# EAGLE design board (EAGLE 8.3.1)
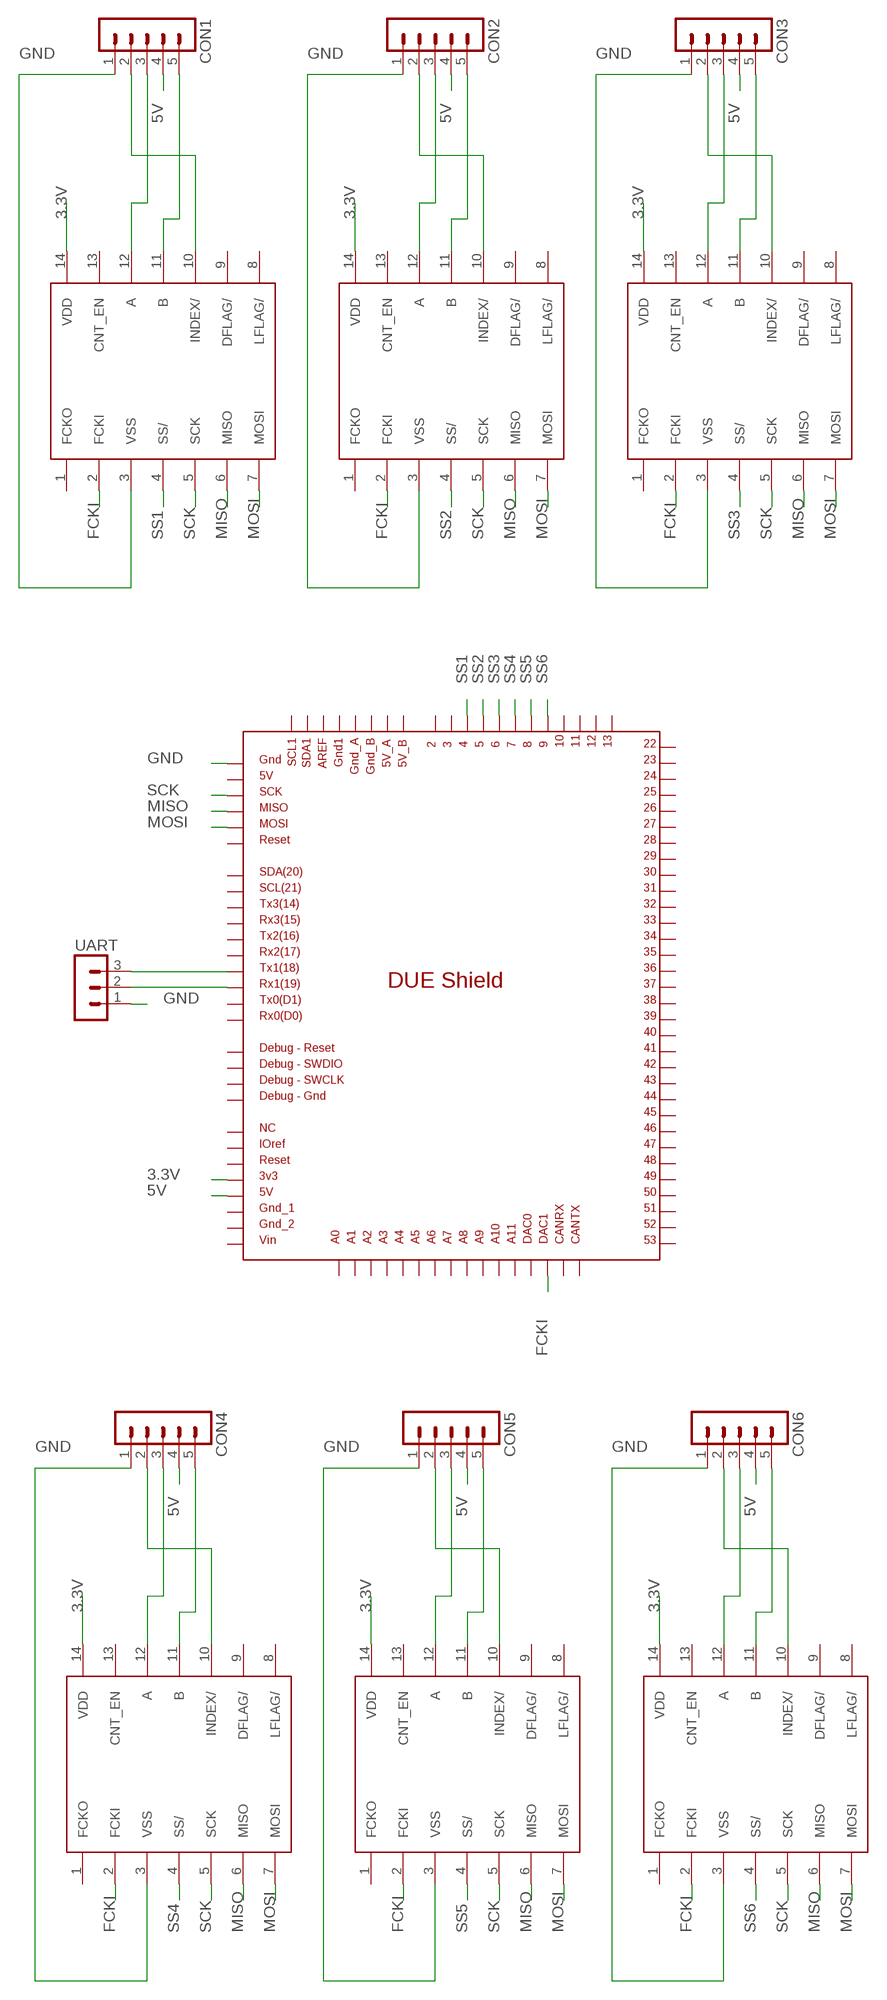
[diagram p0: schematic, sheet 1]

## Parts
CON1  MA05-1  [MA05-1]
CON2  MA05-1  [MA05-1]
CON3  MA05-1  [MA05-1]
CON4  MA05-1  [MA05-1]
CON5  MA05-1  [MA05-1]
CON6  MA05-1  [MA05-1]
IC1  LFLS7366R  [SO14]
IC2  LFLS7366R  [SO14]
IC3  LFLS7366R  [SO14]
IC4  LFLS7366R  [SO14]
IC5  LFLS7366R  [SO14]
IC6  LFLS7366R  [SO14]
U$7  DUE(NORMAL)  [DUE(NORMAL)]
UART  MA03-1  [MA03-1]

## Nets
3.3V: IC1.14(VDD) IC2.14(VDD) IC3.14(VDD) IC4.14(VDD) IC5.14(VDD) IC6.14(VDD) U$7.3V3
5V: CON1.4 CON2.4 CON3.4 CON4.4 CON5.4 CON6.4 U$7.5V
FCKI: IC1.2(FCKI) IC2.2(FCKI) IC3.2(FCKI) IC4.2(FCKI) IC5.2(FCKI) IC6.2(FCKI) U$7.DAC1
GND: CON1.1 CON2.1 CON3.1 CON4.1 CON5.1 CON6.1 IC1.3(VSS) IC2.3(VSS) IC3.3(VSS) IC4.3(VSS) IC5.3(VSS) IC6.3(VSS) U$7.5V_ICSP UART.1
MISO: IC1.6(MISO) IC2.6(MISO) IC3.6(MISO) IC4.6(MISO) IC5.6(MISO) IC6.6(MISO) U$7.MISO_ICSP
MOSI: IC1.7(MOSI) IC2.7(MOSI) IC3.7(MOSI) IC4.7(MOSI) IC5.7(MOSI) IC6.7(MOSI) U$7.MOSI_ICSP
N$2: CON2.2 IC2.10(INDEX/)
N$3: U$7.TX1 UART.3
N$4: U$7.RX1 UART.2
N$5: CON2.3 IC2.12(A)
N$7: CON2.5 IC2.11(B)
N$8: CON3.2 IC3.10(INDEX/)
N$9: CON3.3 IC3.12(A)
N$10: CON3.5 IC3.11(B)
N$12: CON1.2 IC1.10(INDEX/)
N$13: CON1.3 IC1.12(A)
N$14: CON1.5 IC1.11(B)
N$16: CON5.2 IC5.10(INDEX/)
N$17: CON5.3 IC5.12(A)
N$18: CON5.5 IC5.11(B)
N$20: CON6.2 IC6.10(INDEX/)
N$21: CON6.3 IC6.12(A)
N$22: CON6.5 IC6.11(B)
N$24: CON4.2 IC4.10(INDEX/)
N$25: CON4.3 IC4.12(A)
N$26: CON4.5 IC4.11(B)
SCK: IC1.5(SCK) IC2.5(SCK) IC3.5(SCK) IC4.5(SCK) IC5.5(SCK) IC6.5(SCK) U$7.SCK_ICSP
SS1: IC1.4(SS/) U$7.4
SS2: IC2.4(SS/) U$7.5
SS3: IC3.4(SS/) U$7.6
SS4: IC4.4(SS/) U$7.7
SS5: IC5.4(SS/) U$7.8
SS6: IC6.4(SS/) U$7.9
Unconnected: IC1.1(FCKO) IC1.8(LFLAG/) IC1.9(DFLAG/) IC1.13(CNT_EN) IC2.1(FCKO) IC2.8(LFLAG/) IC2.9(DFLAG/) IC2.13(CNT_EN) IC3.1(FCKO) IC3.8(LFLAG/) IC3.9(DFLAG/) IC3.13(CNT_EN) IC4.1(FCKO) IC4.8(LFLAG/) IC4.9(DFLAG/) IC4.13(CNT_EN) IC5.1(FCKO) IC5.8(LFLAG/) IC5.9(DFLAG/) IC5.13(CNT_EN) IC6.1(FCKO) IC6.8(LFLAG/) IC6.9(DFLAG/) IC6.13(CNT_EN) U$7.2 U$7.3 U$7.5V_A U$7.5V_B U$7.10 U$7.11 U$7.12 U$7.13 U$7.22 U$7.23 U$7.24 U$7.25 U$7.26 U$7.27 U$7.28 U$7.29 U$7.30 U$7.31 U$7.32 U$7.33 U$7.34 U$7.35 U$7.36 U$7.37 U$7.38 U$7.39 U$7.40 U$7.41 U$7.42 U$7.43 U$7.44 U$7.45 U$7.46 U$7.47 U$7.48 U$7.49 U$7.50 U$7.51 U$7.52 U$7.53 U$7.A0 U$7.A1 U$7.A2 U$7.A3 U$7.A4 U$7.A5 U$7.A6 U$7.A7 U$7.A8 U$7.A9 U$7.A10 U$7.A11 U$7.AREF U$7.CANRX U$7.CANTX U$7.DAC0 U$7.GND1 U$7.GND_1 U$7.GND_2 U$7.GND_A U$7.GND_B U$7.GND_DEBUG U$7.GND_ICSP U$7.IOREF U$7.NC U$7.RESET U$7.RESET_DEBUG U$7.RESET_ICSP U$7.RX0 U$7.RX2 U$7.RX3 U$7.SCL U$7.SCL1 U$7.SDA U$7.SDA1 U$7.SWCLK_DEBUG U$7.SWDIO_DEBUG U$7.TX0 U$7.TX2 U$7.TX3 U$7.VIN

## Library data of the parts
CON1-CON6 = con-lstb:MA05-1: PIN HEADER; OC_FARNELL: unknown; OC_NEWARK: unknown
IC1-IC6 = encoder_project:LFLS7366R
U$7 = DUElib130425:DUE(NORMAL)
UART = con-lstb:MA03-1: PIN HEADER; OC_FARNELL: unknown; OC_NEWARK: unknown

## Net classes
0 default: width 0.508 mm, drill 0.33 mm, clearance 0.254 mm

## Board
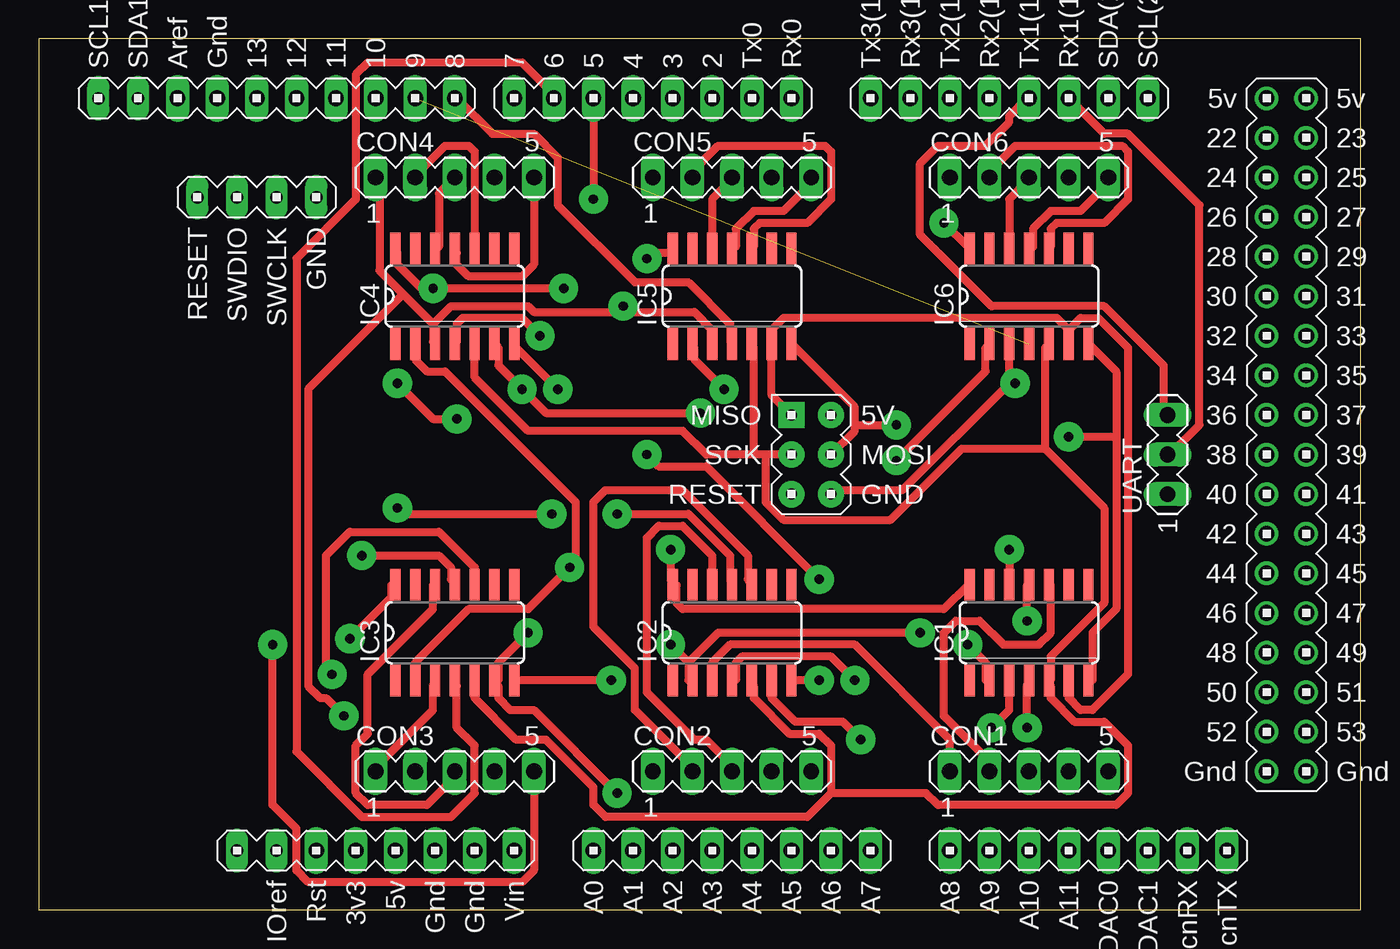
[diagram p1: board, top side]
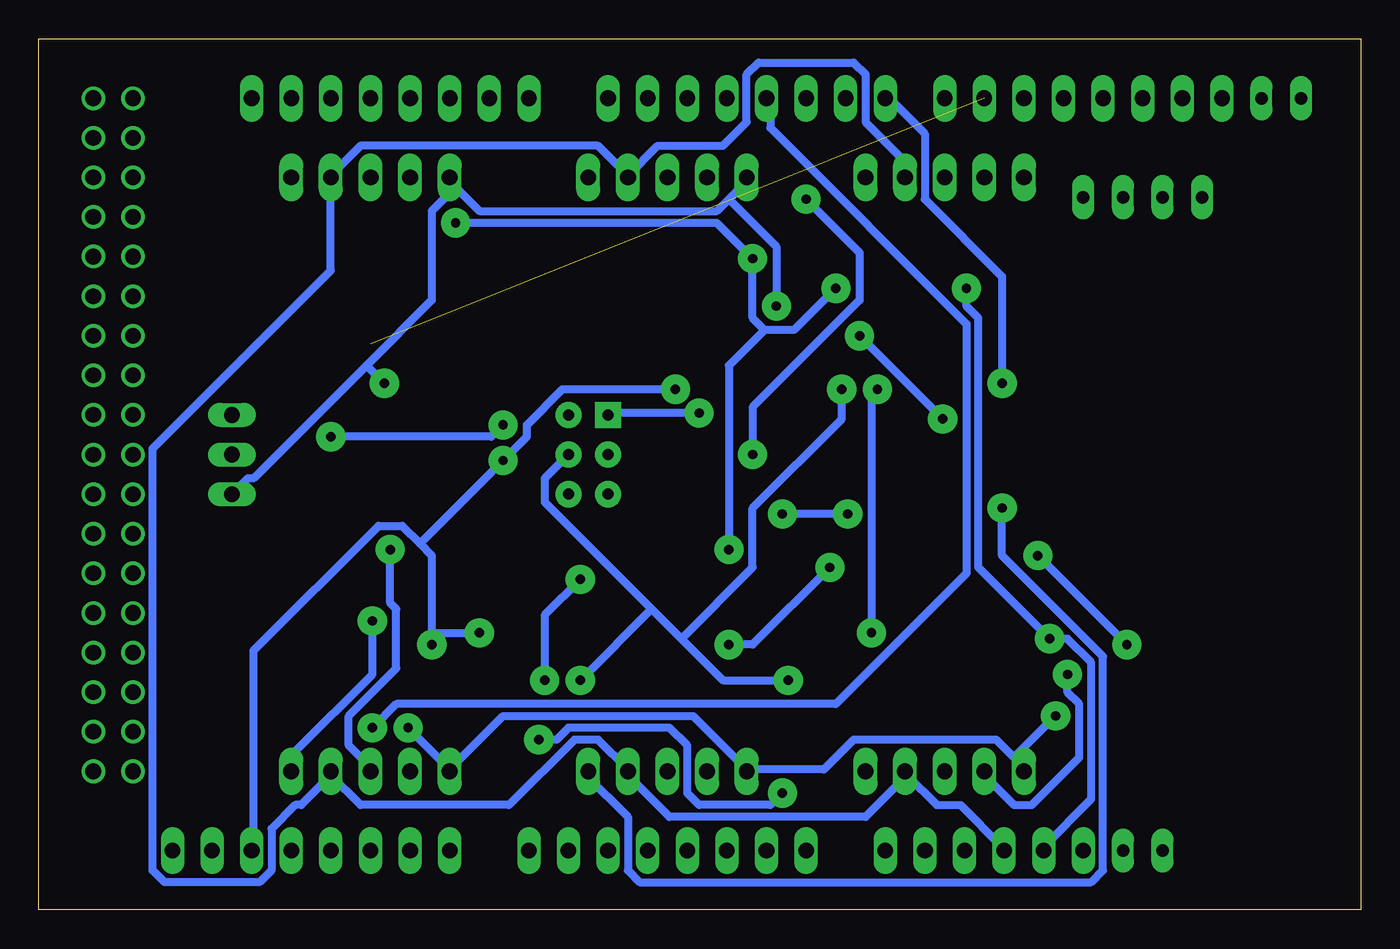
[diagram p2: board, bottom side, seen from below]

Size 84.76 x 55.87 mm. Coordinates in mm from the lower left corner, seen from the top.
Outline: 0,0 84.76,0 84.76,55.87 0,55.87 0,0
Copper layers (1*16): Top 0.035mm / dielectric 1.5mm / Bottom 0.035mm
Design rules "default *": minimum track width 6mil, minimum drill 0.6mm, track to track 6mil, track to pad 6mil, pad to pad 6mil, via to via 6mil, smd to smd 6mil, copper to edge 40mil, drill to drill 6mil, minimum pad ring 10mil, minimum via ring 25mil, stop-mask expansion 4mil, vias tented up to drill 0mil, thermal gap 10mil

### Footprints (pad centres in the part's own frame; a part is rotated, then mirrored left to right if it is on the bottom)
MA05-1 = drill 1.016 long: 1 -5.08,0; 2 -2.54,0; 3 0,0; 4 2.54,0; 5 5.08,0
SO14 = smd 0.66 x 2.032: 1 -3.81,-3.073; 2 -2.54,-3.073; 3 -1.27,-3.073; 4 0,-3.073; 5 1.27,-3.073; 6 2.54,-3.073; 7 3.81,-3.073; 8 3.81,3.073; 9 2.54,3.073; 10 1.27,3.073; 11 0,3.073; 12 -1.27,3.073; 13 -2.54,3.073; 14 -3.81,3.073
DUE(NORMAL) = drill 1 long: 2 -16.51,30.48; 3 -19.05,30.48; 3V3 -39.37,-17.78; 4 -21.59,30.48; 5 -24.13,30.48; 5V -36.83,-17.78; 6 -26.67,30.48; 7 -29.21,30.48; 8 -33.02,30.48; 9 -35.56,30.48; 10 -38.1,30.48; 11 -40.64,30.48; 12 -43.18,30.48; 13 -45.72,30.48; A0 -24.13,-17.78; A1 -21.59,-17.78; A2 -19.05,-17.78; A3 -16.51,-17.78; A4 -13.97,-17.78; A5 -11.43,-17.78; A6 -8.89,-17.78; A7 -6.35,-17.78; A8 -1.27,-17.78; A9 1.27,-17.78; A10 3.81,-17.78; A11 6.35,-17.78; AREF -50.8,30.48; AREF1 -50.8,30.48; CANRX 13.97,-17.78; CANTX 16.51,-17.78; DAC0 8.89,-17.78; DAC1 11.43,-17.78; GND1 -48.26,30.48; GND_1 -34.29,-17.78; GND_2 -31.75,-17.78; RESET -41.91,-17.78; RX0 -11.43,30.48; RX1 6.35,30.48; RX2 1.27,30.48; RX3 -3.81,30.48; SCL 11.43,30.48; SDA 8.89,30.48; TX0 -13.97,30.48; TX1 3.81,30.48; TX2 -1.27,30.48; TX3 -6.35,30.48; VIN -29.21,-17.78 | drill 1: 5V_A 19.05,30.48; 5V_B 21.59,30.48; 22 19.05,27.94; 23 21.59,27.94; 24 19.05,25.4; 25 21.59,25.4; 26 19.05,22.86; 27 21.59,22.86; 28 19.05,20.32; 29 21.59,20.32; 30 19.05,17.78; 31 21.59,17.78; 32 19.05,15.24; 33 21.59,15.24; 34 19.05,12.7; 35 21.59,12.7; 36 19.05,10.16; 37 21.59,10.16; 38 19.05,7.62; 39 21.59,7.62; 40 19.05,5.08; 41 21.59,5.08; 42 19.05,2.54; 43 21.59,2.54; 44 19.05,0; 45 21.59,0; 46 19.05,-2.54; 47 21.59,-2.54; 48 19.05,-5.08; 49 21.59,-5.08; 50 19.05,-7.62; 51 21.59,-7.62; 52 19.05,-10.16; 53 21.59,-10.16; GND_A 19.05,-12.7; GND_B 21.59,-12.7 | drill 0.7 pad 1.676: 5V_ICSP -8.89,5.08; GND_ICSP -8.89,10.16; MOSI_ICSP -8.89,7.62; RESET_ICSP -11.43,5.08; SCK_ICSP -11.43,7.62 | drill 0.8 pad 1.422 long: GND_DEBUG -41.91,24.13; IOREF -44.45,-17.78; NC -46.99,-17.78; RESET_DEBUG -49.53,24.13; SCL1 -55.88,30.48; SDA1 -53.34,30.48; SWCLK_DEBUG -44.45,24.13; SWDIO_DEBUG -46.99,24.13 | drill 0.7 pad 1.676 square: MISO_ICSP -11.43,10.16
MA03-1 = drill 1.016 long: 1 -2.54,0; 2 0,0; 3 2.54,0

### Placement (x,y rotation side)
CON1  63.5,8.89 0 top
CON2  44.45,8.89 0 top
CON3  26.67,8.89 0 top
CON4  26.67,46.99 0 top
CON5  44.45,46.99 0 top
CON6  63.5,46.99 0 top
IC1  63.5,17.78 0 top
IC2  44.45,17.78 0 top
IC3  26.67,17.78 0 top
IC4  26.67,39.37 0 top
IC5  44.45,39.37 0 top
IC6  63.5,39.37 0 top
U$7  59.69,21.59 0 top
UART  72.39,29.21 90 top

### Tracks (layer width: path | path; a pad name or v marks a point on that pad's centre or on a via)
3.3V  (via drill 0.6)
  Top 0.508: IC1.14 59.56,20.83 58.04,19.3 41.27,19.3 40.89,19.68 40.89,20.83 IC2.14 40.51,21.21 v40.51,23.11 | v19.94,17.4 22.61,20.07 22.61,20.83 IC3.14 | IC4.14 22.99,42.16 22.99,41.4 24.51,39.88 v25.27,39.88 v33.66,39.88 | v38.99,41.78 39.37,42.16 40.51,42.16 IC5.14 | v58.04,44.07 59.56,42.54 IC6.14
  Bottom 0.508: U$7.3V3 20.32,4.06 17.27,7.11 17.27,15.88 18.8,17.4 v19.94,17.4 24.51,21.97 24.51,37.97 25.27,38.73 v25.27,39.88 | 38.23,37.21 38.99,37.97 v38.99,41.78 41.27,44.07 v58.04,44.07 | 38.23,37.21 36.32,37.21 v33.66,39.88 | v40.51,23.11 40.51,34.92 38.23,37.21
5V
  Bottom 0.508: 46.99,47.12 45.09,49.02 40.89,49.02 39.37,50.55 39.37,53.59 38.61,54.36 32.51,54.36 31.75,53.59 31.75,50.55 29.46,48.26 29.46,47.12 CON4.4 | 46.99,47.12 48.9,49.02 64.13,49.02 66.04,47.12 CON6.4 66.04,41.02 77.47,29.59 77.47,2.54 76.71,1.78 70.61,1.78 69.85,2.54 69.85,5.21 68.33,6.73 67.94,6.73 66.04,8.64 | 46.99,47.12 CON5.4 | 29.08,8.64 27.18,6.73 25.65,6.73 22.99,4.06 U$7.5V | 29.08,8.64 31.75,5.97 44.32,5.97 46.99,8.64 CON2.4 46.99,9.02 48.9,10.92 50.42,10.92 54.61,6.73 64.13,6.73 66.04,8.64 | 29.08,8.64 CON3.4 | 66.04,8.64 CON1.4
FCKI  (via drill 0.6)
  Top 0.508: IC3.2 24.13,15.88 27.56,19.3 31.37,19.3 v34.04,21.97 34.42,22.35 34.42,26.16 26.04,34.54 24.89,34.54 24.13,35.31 IC4.2 | 41.66,15.88 41.66,14.73 IC2.2 | v40.51,17.02 41.66,15.88 | v59.56,17.02 60.71,15.88 60.71,14.73 IC1.2 | v43.94,33.4 42.04,35.31 42.04,36.07 IC5.2 | v54.99,28.83 60.71,34.54 60.71,36.07 IC6.2 | 41.66,15.88 43.56,17.78 v56.52,17.78
  Bottom 0.508: v40.51,17.02 38.99,17.02 v34.04,21.97 | 59.56,17.78 59.56,22.73 60.33,23.5 | 60.33,23.5 61.47,24.64 62.99,24.64 70.99,16.64 70.99,4.06 U$7.DAC1 | v43.94,33.4 51.18,33.4 53.47,31.11 53.47,30.35 v54.99,28.83 60.33,23.5 | 59.56,17.78 v56.52,17.78 | 59.56,17.78 v59.56,17.02
GND  (via drill 0.6)
  Top 0.508: IC3.3 25.27,14.35 25.27,12.83 21.46,9.02 CON3.1 | IC2.3 43.18,15.88 44.32,17.02 52.32,17.02 58.42,10.92 CON1.1 | IC1.3 62.23,12.83 v61.09,11.68 | 25.27,37.59 25.27,36.45 IC4.3 | 23.37,39.5 21.84,41.02 21.84,46.74 CON4.1 | 23.37,39.5 25.27,37.59 | IC5.3 43.18,37.21 42.04,38.35 37.47,38.35 | 37.47,38.35 31.75,38.35 31.37,38.73 26.42,38.73 25.27,37.59 | 62.23,33.78 IC6.3 | 62.23,33.78 55.37,26.92 50.8,26.92 U$7.5V_ICSP | v62.61,33.78 62.23,33.78 | v37.47,38.73 37.47,38.35 | v19.56,12.45 18.41,13.59 18.03,13.59 17.27,14.35 17.27,33.4 23.37,39.5
  Bottom 0.508: 39.37,9.02 34.42,9.02 32.51,10.92 23.37,10.92 22.23,9.78 | 22.23,9.78 21.46,9.02 CON3.1 22.23,9.78 | 58.42,9.02 v61.09,11.68 | 39.37,9.02 42.8,12.45 54.99,12.45 58.42,9.02 | 39.37,9.02 CON2.1 | 58.42,9.02 CON1.1 | 40.51,45.59 41.27,44.83 56.52,44.83 58.04,46.35 | 40.51,45.59 39.37,46.74 CON5.1 | 58.04,46.35 58.42,46.74 CON6.1 58.04,46.35 | UART.1 71.37,27.69 70.99,27.69 63.75,34.92 | 63.75,34.92 59.56,39.12 59.56,44.83 58.04,46.35 | 63.75,34.92 v62.61,33.78 | v37.47,38.73 37.47,42.54 40.51,45.59 | v19.56,12.45 22.23,9.78
MISO  (via drill 0.6)
  Top 0.508: U$7.MISO_ICSP 46.99,33.02 IC5.6 46.99,37.21 47.75,37.97 65.28,37.97 66.04,37.21 | IC1.6 66.04,13.59 66.8,12.83 67.56,12.83 69.85,15.11 69.85,36.07 67.94,37.97 66.8,37.97 66.04,37.21 | 66.04,37.21 IC6.6 | v31.37,17.78 29.46,15.88 29.46,14.73 IC3.6 29.46,14.35 29.46,13.59 30.23,12.83 31.75,12.83 v37.08,7.49 | IC4.6 29.46,36.07 29.46,34.92 v30.99,33.4 32.51,31.88 v42.42,31.88 | IC2.6 46.99,13.59 48.51,12.07 51.56,12.07 v52.7,10.92
  Bottom 0.508: v31.37,17.78 31.37,33.02 v30.99,33.4 | v52.7,10.92 51.56,10.92 50.8,11.68 44.32,11.68 43.18,10.54 43.18,7.49 42.42,6.73 37.85,6.73 v37.08,7.49 | v42.42,31.88 48.13,31.88 U$7.MISO_ICSP
MOSI  (via drill 0.6)
  Top 0.508: 69.09,30.35 69.09,34.54 67.56,36.07 IC6.7 | 69.09,30.35 69.09,19.3 67.56,17.78 67.56,14.73 IC1.7 | v36.7,14.73 30.61,14.73 IC3.7 | v50.04,14.73 48.51,14.73 IC2.7 | v33.27,33.4 30.61,36.07 IC4.7 | 52.32,31.11 52.32,30.73 U$7.MOSI_ICSP | 52.32,31.11 52.32,32.26 48.51,36.07 IC5.7 | v66.04,30.35 69.09,30.35 | 52.32,31.11 v54.99,31.11
  Bottom 0.508: v36.7,14.73 40.89,14.73 43.56,17.4 | 45.47,19.3 52.32,26.16 52.32,27.69 U$7.MOSI_ICSP | 45.47,19.3 43.56,17.4 | 45.47,19.3 v50.04,14.73 | v33.27,33.4 33.27,31.5 38.99,25.78 38.99,21.97 43.56,17.4 | v66.04,30.35 55.75,30.35 v54.99,31.11
N$2
  Top 0.508: IC2.10 45.47,21.21 45.47,22.73 41.27,26.92 36.32,26.92 35.56,26.16 35.56,18.16 38.23,15.49 38.23,12.83 42.04,9.02 CON2.2
N$3
  Top 0.508: U$7.TX1 63.37,52.07 62.23,50.93 62.23,50.55 60.71,49.02 57.66,49.02 56.52,47.88 56.52,43.31 61.09,38.73 68.33,38.73 72.14,34.92 72.14,31.88 UART.3
N$4
  Top 0.508: U$7.RX1 68.33,49.78 69.85,49.78 74.42,45.21 74.42,31.11 72.52,29.21 UART.2
N$5
  Top 0.508: IC2.12 43.18,22.73 41.27,24.64 39.75,24.64 38.99,23.88 38.99,13.97 42.04,10.92 42.8,10.92 44.7,9.02 CON2.3
N$7  (via drill 0.6)
  Top 0.508: v37.08,25.4 41.66,25.4 44.32,22.73 44.32,21.21 IC2.11 | v32.89,25.4 23.37,25.4 v22.99,25.78
  Bottom 0.508: v32.89,25.4 v37.08,25.4 | v22.99,25.78 22.99,22.73 16.51,16.26 16.51,2.54 17.27,1.78 46.23,1.78 46.99,2.54 46.99,5.97 49.66,8.64 CON2.5
N$8  (via drill 0.6)
  Top 0.508: IC3.10 27.94,21.97 25.65,24.26 19.94,24.26 18.41,22.73 18.41,15.49 v18.8,15.11
  Bottom 0.508: v18.8,15.11 18.8,13.97 18.03,13.21 18.03,9.78 21.08,6.73 22.23,6.73 24.13,8.64 CON3.2
N$9
  Top 0.508: IC3.12 25.27,20.83 25.27,19.3 21.08,15.11 21.08,11.3 20.32,10.54 20.32,7.49 21.08,6.73 24.89,6.73 26.8,8.64 CON3.3
N$10  (via drill 0.6)
  Top 0.508: v20.7,22.73 25.65,22.73 26.42,21.97 26.42,21.21 IC3.11 | v14.99,17.02 14.99,6.73 16.51,5.21 16.51,2.54 17.27,1.78 30.99,1.78 31.75,2.54 CON3.5
  Bottom 0.508: v14.99,17.02 v20.7,22.73
N$12
  Top 0.508: IC1.10 64.9,20.83 64.9,17.78 64.13,17.02 61.85,17.02 60.33,18.54 58.8,18.54 58.04,17.78 58.04,12.45 60.71,9.78 60.71,9.02 CON1.2
N$13  (via drill 0.6)
  Top 0.508: v62.23,23.11 IC1.12
  Bottom 0.508: v62.23,23.11 62.23,19.68 61.85,19.3 61.85,15.49 64.9,12.45 64.9,10.54 63.37,9.02 CON1.3
N$14  (via drill 0.6)
  Top 0.508: v63.37,18.54 63.37,20.83 IC1.11
  Bottom 0.508: v63.37,18.54 63.37,15.11 68.33,10.16 68.33,9.02 CON1.5
N$16
  Top 0.508: IC5.10 45.85,42.54 45.85,43.69 46.23,44.07 49.28,44.07 50.8,45.59 50.8,48.64 50.42,49.02 43.56,49.02 41.66,47.12 CON5.2
N$17
  Top 0.508: IC5.12 43.18,45.59 44.32,46.74 CON5.3
N$18
  Top 0.508: IC5.11 44.7,42.54 44.7,43.69 45.85,44.83 47.75,44.83 49.66,46.74 CON5.5
N$20
  Top 0.508: IC6.10 64.9,42.54 64.9,43.69 65.28,44.07 68.33,44.07 69.85,45.59 69.85,48.64 69.47,49.02 62.61,49.02 60.71,47.12 CON6.2
N$21
  Top 0.508: IC6.12 62.23,45.59 63.37,46.74 CON6.3
N$22
  Top 0.508: IC6.11 63.75,42.54 63.75,43.69 64.9,44.83 66.8,44.83 68.71,46.74 CON6.5
N$24
  Top 0.508: IC4.10 27.94,48.64 27.56,49.02 26.04,49.02 24.13,47.12 CON4.2
N$25
  Top 0.508: CON4.3 25.65,45.97 25.65,42.54 IC4.12
N$26
  Top 0.508: CON4.5 31.75,41.4 30.99,40.64 27.56,40.64 26.8,41.4 26.8,42.16 IC4.11
SCK
  Top 0.508: IC3.5 27.94,13.59 30.61,10.92 32.51,10.92 35.56,7.87 35.56,6.73 36.32,5.97 49.28,5.97 50.8,7.49 | 50.8,7.49 50.8,10.54 50.04,11.3 48.13,11.3 45.85,13.59 45.85,14.35 IC2.5 | 64.52,29.59 68.33,25.78 68.33,19.68 64.9,16.26 64.9,14.73 IC1.5 64.9,14.35 64.9,13.59 66.42,12.07 68.33,12.07 69.85,10.54 69.85,7.49 69.09,6.73 57.66,6.73 56.9,7.49 50.8,7.49 | 64.52,29.59 64.52,36.07 IC6.5 | IC4.5 27.94,34.16 31.37,30.73 41.27,30.73 42.8,29.21 45.85,29.21 | U$7.SCK_ICSP 46.61,29.21 | 46.61,29.21 45.85,29.21 | 45.85,29.21 45.85,36.07 IC5.5 | 64.52,29.59 59.18,29.59 54.61,25.02 47.75,25.02 46.61,26.16 46.61,29.21
SS1  (via drill 0.6)
  Top 0.508: v63.37,11.68 63.37,14.35 IC1.4
  Bottom 0.508: v63.37,11.68 61.85,13.21 33.66,13.21 25.27,21.59 25.27,37.59 37.85,50.16 37.85,52.07 U$7.4
SS2  (via drill 0.6)
  Top 0.508: v52.32,14.73 50.8,16.26 45.09,16.26 44.7,15.88 44.7,14.73 IC2.4 | v50.04,21.21 42.8,28.45 39.75,28.45 v38.99,29.21 | U$7.5 v35.56,45.59
  Bottom 0.508: v52.32,14.73 52.32,18.92 v50.04,21.21 | v38.99,29.21 38.99,32.26 32.13,39.12 32.13,42.16 v35.56,45.59
SS3
  Top 0.508: IC3.4 26.8,14.35 26.8,11.68 27.94,10.54 27.94,7.49 26.42,5.97 20.7,5.97 16.51,10.16 16.51,41.78 20.32,45.59 20.32,53.59 21.08,54.36 30.99,54.36 33.27,52.07 U$7.6
SS4  (via drill 0.6)
  Top 0.508: v32.13,36.83 30.99,37.97 27.18,37.97 26.8,37.59 26.8,36.45 IC4.4 | v26.8,31.5 25.27,31.5 v22.99,33.78
  Bottom 0.508: v26.8,31.5 v32.13,36.83 | v22.99,33.78 22.99,40.64 27.94,45.59 27.94,49.78 30.23,52.07 U$7.7
SS5
  Top 0.508: IC5.4 44.32,36.45 44.32,37.59 41.66,40.26 38.23,40.26 33.27,45.21 33.27,48.26 31.75,49.78 29.08,49.78 26.8,52.07 U$7.8
SS6  (1 unrouted)